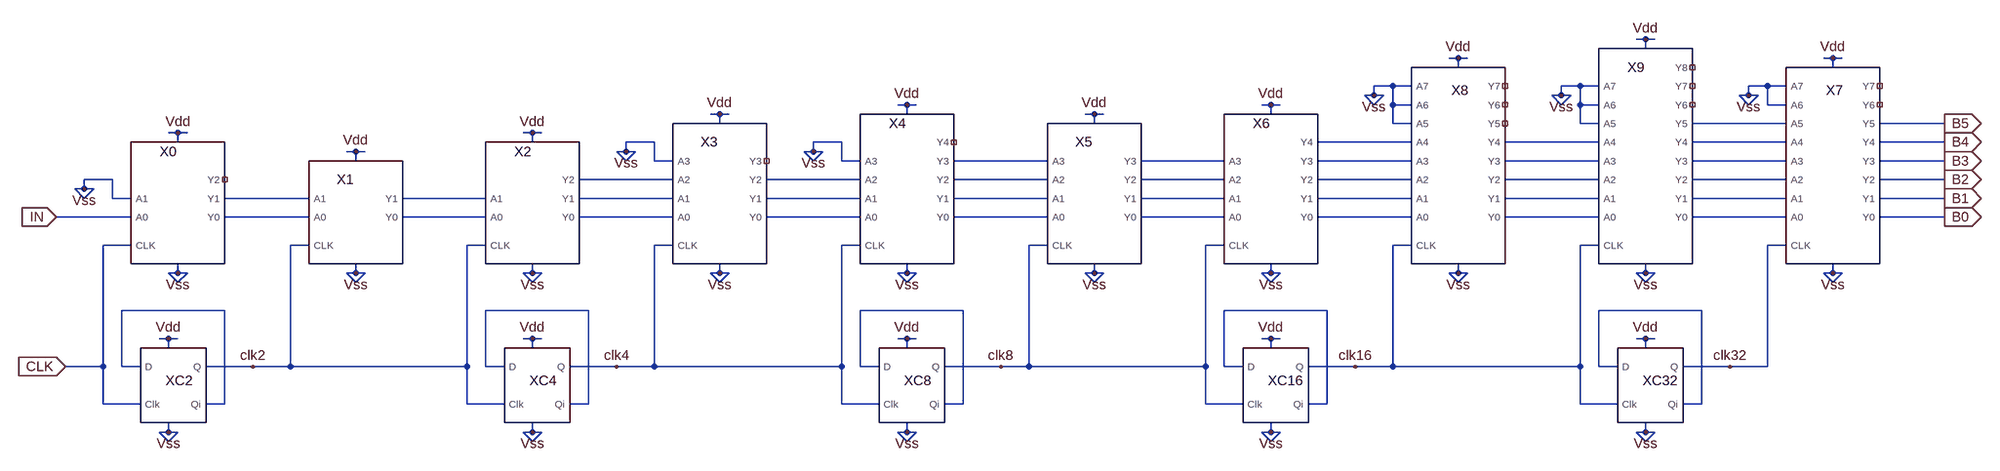
[diagram p0: schematic 5bit_sinc_filter_1st_order.asc]
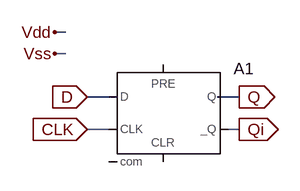
[diagram p1: sub-circuit dff.asc]
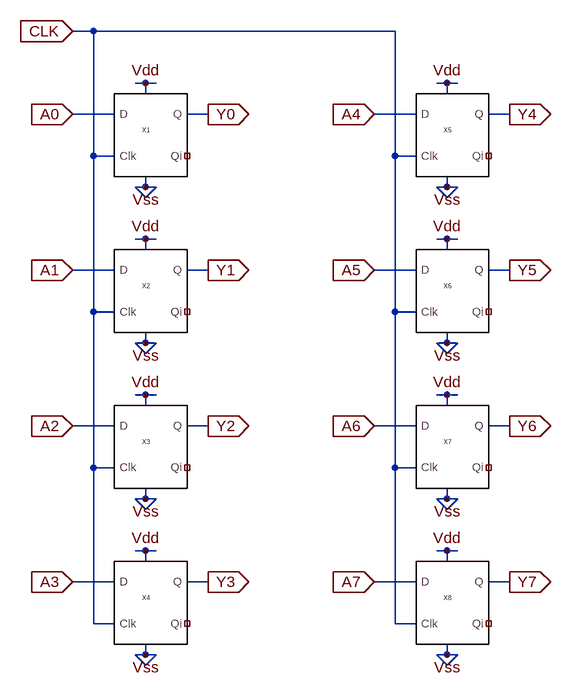
[diagram p2: sub-circuit 8bitreg.asc]
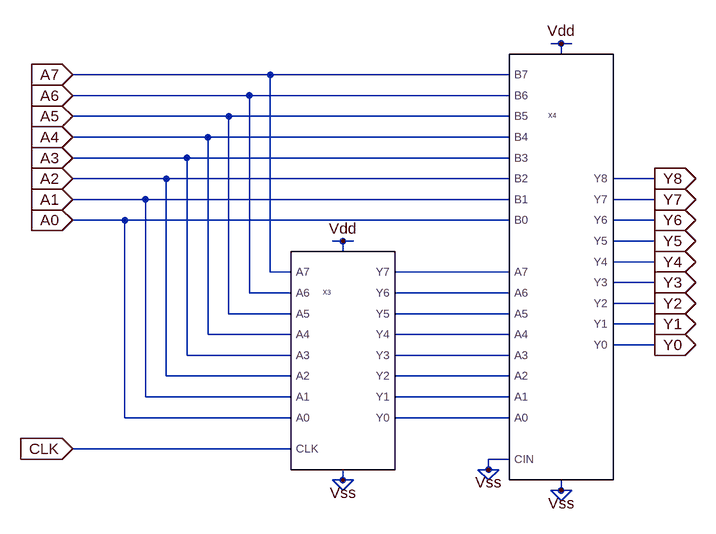
[diagram p3: sub-circuit 8bitavg.asc]
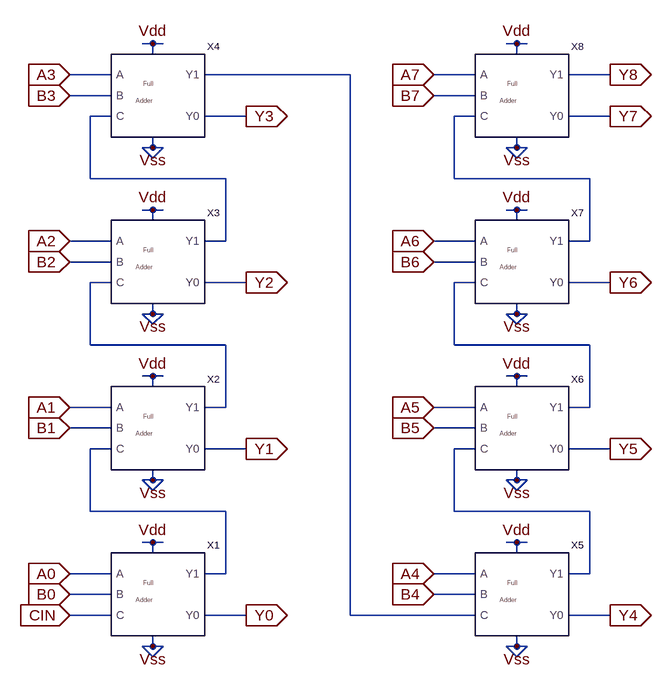
[diagram p4: sub-circuit 8bitadder.asc]
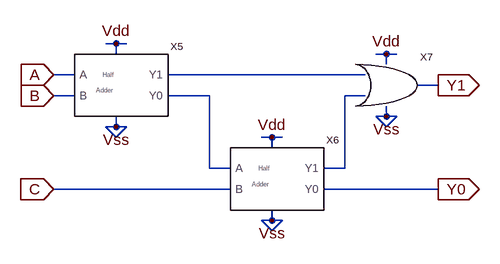
[diagram p5: sub-circuit fulladder.asc]
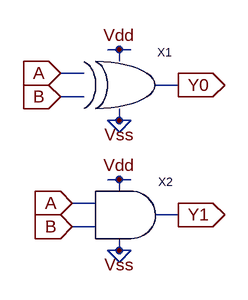
[diagram p6: sub-circuit halfadder.asc]
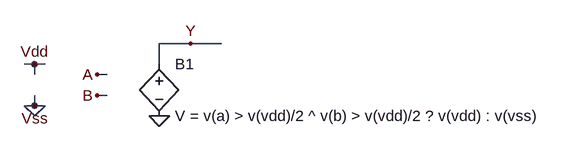
[diagram p7: sub-circuit xor.asc]
5bit_sinc_filter_1st_order.asc, the LTspice schematic file:
Version 4
SHEET 1 4532 1092
WIRE 2544 48 2528 48
WIRE 2560 48 2544 48
WIRE 2544 64 2544 48
WIRE 2224 80 2208 80
WIRE 2240 80 2224 80
WIRE 2864 80 2848 80
WIRE 2880 80 2864 80
WIRE 2224 96 2224 80
WIRE 2864 96 2864 80
WIRE 2112 128 2080 128
WIRE 2144 128 2112 128
WIRE 2432 128 2400 128
WIRE 2464 128 2432 128
WIRE 2752 128 2720 128
WIRE 2784 128 2752 128
WIRE 2080 144 2080 128
WIRE 2080 144 2064 144
WIRE 2096 144 2080 144
WIRE 2400 144 2400 128
WIRE 2400 144 2384 144
WIRE 2416 144 2400 144
WIRE 2720 144 2720 128
WIRE 2720 144 2704 144
WIRE 2736 144 2720 144
WIRE 1264 160 1248 160
WIRE 1280 160 1264 160
WIRE 1904 160 1888 160
WIRE 1920 160 1904 160
WIRE 2080 160 2064 144
WIRE 2080 160 2096 144
WIRE 2112 160 2112 128
WIRE 2144 160 2112 160
WIRE 2400 160 2384 144
WIRE 2400 160 2416 144
WIRE 2432 160 2432 128
WIRE 2464 160 2432 160
WIRE 2720 160 2704 144
WIRE 2720 160 2736 144
WIRE 2752 160 2752 128
WIRE 2784 160 2752 160
WIRE 944 176 928 176
WIRE 960 176 944 176
WIRE 1264 176 1264 160
WIRE 1584 176 1568 176
WIRE 1600 176 1584 176
WIRE 1904 176 1904 160
WIRE 944 192 944 176
WIRE 1584 192 1584 176
WIRE 2112 192 2112 160
WIRE 2144 192 2112 192
WIRE 2432 192 2432 160
WIRE 2464 192 2432 192
WIRE 2784 192 2624 192
WIRE 3136 192 2944 192
WIRE 0 208 -16 208
WIRE 16 208 0 208
WIRE 624 208 608 208
WIRE 640 208 624 208
WIRE 0 224 0 208
WIRE 624 224 624 208
WIRE 832 224 784 224
WIRE 1152 224 1104 224
WIRE 2144 224 1984 224
WIRE 2464 224 2304 224
WIRE 2784 224 2624 224
WIRE 3136 224 2944 224
WIRE 304 240 288 240
WIRE 320 240 304 240
WIRE 784 240 784 224
WIRE 784 240 768 240
WIRE 800 240 784 240
WIRE 1104 240 1104 224
WIRE 1104 240 1088 240
WIRE 1120 240 1104 240
WIRE 304 256 304 240
WIRE 784 256 768 240
WIRE 784 256 800 240
WIRE 832 256 832 224
WIRE 864 256 832 256
WIRE 1104 256 1088 240
WIRE 1104 256 1120 240
WIRE 1152 256 1152 224
WIRE 1184 256 1152 256
WIRE 1504 256 1344 256
WIRE 1824 256 1664 256
WIRE 2144 256 1984 256
WIRE 2464 256 2304 256
WIRE 2784 256 2624 256
WIRE 3136 256 2944 256
WIRE -112 288 -160 288
WIRE 864 288 704 288
WIRE 1184 288 1024 288
WIRE 1504 288 1344 288
WIRE 1824 288 1664 288
WIRE 2144 288 1984 288
WIRE 2464 288 2304 288
WIRE 2784 288 2624 288
WIRE 3136 288 2944 288
WIRE -160 304 -160 288
WIRE -160 304 -176 304
WIRE -144 304 -160 304
WIRE -160 320 -176 304
WIRE -160 320 -144 304
WIRE -112 320 -112 288
WIRE -80 320 -112 320
WIRE 224 320 80 320
WIRE 544 320 384 320
WIRE 864 320 704 320
WIRE 1184 320 1024 320
WIRE 1504 320 1344 320
WIRE 1824 320 1664 320
WIRE 2144 320 1984 320
WIRE 2464 320 2304 320
WIRE 2784 320 2624 320
WIRE 3136 320 2944 320
WIRE -80 352 -208 352
WIRE 224 352 80 352
WIRE 544 352 384 352
WIRE 864 352 704 352
WIRE 1184 352 1024 352
WIRE 1504 352 1344 352
WIRE 1824 352 1664 352
WIRE 2144 352 1984 352
WIRE 2464 352 2304 352
WIRE 2784 352 2624 352
WIRE 3136 352 2944 352
WIRE -80 400 -128 400
WIRE 224 400 192 400
WIRE 544 400 512 400
WIRE 864 400 832 400
WIRE 1184 400 1152 400
WIRE 1504 400 1472 400
WIRE 1824 400 1792 400
WIRE 2144 400 2112 400
WIRE 2464 400 2432 400
WIRE 2784 400 2752 400
WIRE 0 448 0 432
WIRE 0 448 -16 448
WIRE 16 448 0 448
WIRE 304 448 304 432
WIRE 304 448 288 448
WIRE 320 448 304 448
WIRE 624 448 624 432
WIRE 624 448 608 448
WIRE 640 448 624 448
WIRE 944 448 944 432
WIRE 944 448 928 448
WIRE 960 448 944 448
WIRE 1264 448 1264 432
WIRE 1264 448 1248 448
WIRE 1280 448 1264 448
WIRE 1584 448 1584 432
WIRE 1584 448 1568 448
WIRE 1600 448 1584 448
WIRE 1904 448 1904 432
WIRE 1904 448 1888 448
WIRE 1920 448 1904 448
WIRE 2224 448 2224 432
WIRE 2224 448 2208 448
WIRE 2240 448 2224 448
WIRE 2544 448 2544 432
WIRE 2544 448 2528 448
WIRE 2560 448 2544 448
WIRE 2864 448 2864 432
WIRE 2864 448 2848 448
WIRE 2880 448 2864 448
WIRE 0 464 -16 448
WIRE 0 464 16 448
WIRE 304 464 288 448
WIRE 304 464 320 448
WIRE 624 464 608 448
WIRE 624 464 640 448
WIRE 944 464 928 448
WIRE 944 464 960 448
WIRE 1264 464 1248 448
WIRE 1264 464 1280 448
WIRE 1584 464 1568 448
WIRE 1584 464 1600 448
WIRE 1904 464 1888 448
WIRE 1904 464 1920 448
WIRE 2224 464 2208 448
WIRE 2224 464 2240 448
WIRE 2544 464 2528 448
WIRE 2544 464 2560 448
WIRE 2864 464 2848 448
WIRE 2864 464 2880 448
WIRE 80 512 -96 512
WIRE 720 512 544 512
WIRE 1360 512 1184 512
WIRE 2000 512 1824 512
WIRE 2640 512 2464 512
WIRE -16 560 -32 560
WIRE 0 560 -16 560
WIRE 624 560 608 560
WIRE 640 560 624 560
WIRE 1264 560 1248 560
WIRE 1280 560 1264 560
WIRE 1904 560 1888 560
WIRE 1920 560 1904 560
WIRE 2544 560 2528 560
WIRE 2560 560 2544 560
WIRE -16 576 -16 560
WIRE 624 576 624 560
WIRE 1264 576 1264 560
WIRE 1904 576 1904 560
WIRE 2544 576 2544 560
WIRE -128 608 -128 400
WIRE -128 608 -192 608
WIRE -96 608 -96 512
WIRE -64 608 -96 608
WIRE 128 608 48 608
WIRE 192 608 192 400
WIRE 192 608 128 608
WIRE 512 608 512 400
WIRE 512 608 192 608
WIRE 544 608 544 512
WIRE 576 608 544 608
WIRE 768 608 688 608
WIRE 832 608 832 400
WIRE 832 608 768 608
WIRE 1152 608 1152 400
WIRE 1152 608 832 608
WIRE 1184 608 1184 512
WIRE 1216 608 1184 608
WIRE 1424 608 1328 608
WIRE 1472 608 1472 400
WIRE 1472 608 1424 608
WIRE 1792 608 1792 400
WIRE 1792 608 1472 608
WIRE 1824 608 1824 512
WIRE 1856 608 1824 608
WIRE 2048 608 1968 608
WIRE 2112 608 2112 400
WIRE 2112 608 2048 608
WIRE 2432 608 2432 400
WIRE 2432 608 2112 608
WIRE 2464 608 2464 512
WIRE 2496 608 2464 608
WIRE 2688 608 2608 608
WIRE 2752 608 2752 400
WIRE 2752 608 2688 608
WIRE -128 672 -128 608
WIRE -64 672 -128 672
WIRE 80 672 80 512
WIRE 80 672 48 672
WIRE 512 672 512 608
WIRE 576 672 512 672
WIRE 720 672 720 512
WIRE 720 672 688 672
WIRE 1152 672 1152 608
WIRE 1216 672 1152 672
WIRE 1360 672 1360 512
WIRE 1360 672 1328 672
WIRE 1792 672 1792 608
WIRE 1856 672 1792 672
WIRE 2000 672 2000 512
WIRE 2000 672 1968 672
WIRE 2432 672 2432 608
WIRE 2496 672 2432 672
WIRE 2640 672 2640 512
WIRE 2640 672 2608 672
WIRE -16 720 -16 704
WIRE -16 720 -32 720
WIRE 0 720 -16 720
WIRE 624 720 624 704
WIRE 624 720 608 720
WIRE 640 720 624 720
WIRE 1264 720 1264 704
WIRE 1264 720 1248 720
WIRE 1280 720 1264 720
WIRE 1904 720 1904 704
WIRE 1904 720 1888 720
WIRE 1920 720 1904 720
WIRE 2544 720 2544 704
WIRE 2544 720 2528 720
WIRE 2560 720 2544 720
WIRE -16 736 -32 720
WIRE -16 736 0 720
WIRE 624 736 608 720
WIRE 624 736 640 720
WIRE 1264 736 1248 720
WIRE 1264 736 1280 720
WIRE 1904 736 1888 720
WIRE 1904 736 1920 720
WIRE 2544 736 2528 720
WIRE 2544 736 2560 720
FLAG 304 448 Vss
FLAG 3136 352 B0
IOPIN 3136 352 Out
FLAG 3136 320 B1
IOPIN 3136 320 Out
FLAG 3136 288 B2
IOPIN 3136 288 Out
FLAG 3136 256 B3
IOPIN 3136 256 Out
FLAG 3136 224 B4
IOPIN 3136 224 Out
FLAG 3136 192 B5
IOPIN 3136 192 Out
FLAG -16 560 Vdd
FLAG -16 720 Vss
FLAG 0 448 Vss
FLAG 0 208 Vdd
FLAG -192 608 CLK
IOPIN -192 608 In
FLAG -208 352 IN
IOPIN -208 352 In
FLAG -160 304 Vss
FLAG 624 560 Vdd
FLAG 624 720 Vss
FLAG 944 448 Vss
FLAG 2224 80 Vdd
FLAG 2224 448 Vss
FLAG 1264 560 Vdd
FLAG 1264 720 Vss
FLAG 1264 448 Vss
FLAG 1264 160 Vdd
FLAG 1904 448 Vss
FLAG 1904 160 Vdd
FLAG 2080 144 Vss
FLAG 1904 560 Vdd
FLAG 1904 720 Vss
FLAG 2544 448 Vss
FLAG 2544 48 Vdd
FLAG 2864 448 Vss
FLAG 2400 144 Vss
FLAG 128 608 clk2
FLAG 768 608 clk4
FLAG 1424 608 clk8
FLAG 2048 608 clk16
FLAG 304 240 Vdd
FLAG 944 176 Vdd
FLAG 2720 144 Vss
FLAG 2544 560 Vdd
FLAG 2544 720 Vss
FLAG 2688 608 clk32
FLAG 624 448 Vss
FLAG 624 208 Vdd
FLAG 784 240 Vss
FLAG 1104 240 Vss
FLAG 1584 448 Vss
FLAG 1584 176 Vdd
FLAG 2864 80 Vdd
SYMBOL dff -64 704 R0
SYMATTR InstName XC2
SYMBOL dff 576 704 R0
SYMATTR InstName XC4
SYMBOL dff 1216 704 R0
SYMATTR InstName XC8
SYMBOL dff 1856 704 R0
SYMATTR InstName XC16
SYMBOL 8bitreg 2144 432 R0
WINDOW 1 88 -121 VLeft 0
WINDOW 0 68 -297 Left 0
SYMATTR InstName X8
SYMBOL 8bitavg 2464 432 R0
WINDOW 1 82 -126 VLeft 0
SYMATTR InstName X9
SYMBOL 2bitavg -80 432 R0
SYMATTR InstName X0
SYMBOL dff 2496 704 R0
SYMATTR InstName XC32
SYMBOL 2bitreg 224 432 R0
SYMATTR InstName X1
SYMBOL 2bitavg 544 432 R0
SYMATTR InstName X2
SYMBOL 4bitreg 864 432 R0
SYMATTR InstName X3
SYMBOL 4bitavg 1184 432 R0
SYMATTR InstName X4
SYMBOL 4bitreg 1504 432 R0
SYMATTR InstName X5
SYMBOL 4bitavg 1824 432 R0
SYMATTR InstName X6
SYMBOL 8bitreg 2784 432 R0
WINDOW 1 88 -121 VLeft 0
WINDOW 0 68 -297 Left 0
SYMATTR InstName X7

dff.asc, the sub-circuit schematic file:
Version 4
SHEET 1 880 680
WIRE 64 32 48 32
WIRE 64 64 48 64
WIRE 128 128 96 128
WIRE 320 128 288 128
WIRE 128 176 96 176
WIRE 320 176 304 176
FLAG 96 128 D
IOPIN 96 128 In
FLAG 96 176 CLK
IOPIN 96 176 In
FLAG 320 128 Q
IOPIN 320 128 Out
FLAG 320 176 Qi
IOPIN 320 176 Out
FLAG 48 32 Vdd
FLAG 48 64 Vss
SYMBOL Digital\\dflop 208 80 R0
SYMATTR InstName A1
SYMATTR SpiceLine vhigh=5 tau=1n

8bitreg.asc, the sub-circuit schematic file:
Version 4
SHEET 1 880 1012
WIRE -192 -224 -224 -224
WIRE 272 -224 -192 -224
WIRE -112 -144 -128 -144
WIRE -96 -144 -112 -144
WIRE 352 -144 336 -144
WIRE 368 -144 352 -144
WIRE -112 -128 -112 -144
WIRE 352 -128 352 -144
WIRE -160 -96 -224 -96
WIRE -16 -96 -48 -96
WIRE 304 -96 240 -96
WIRE 448 -96 416 -96
WIRE -192 -32 -192 -224
WIRE -160 -32 -192 -32
WIRE 272 -32 272 -224
WIRE 304 -32 272 -32
WIRE -112 16 -112 0
WIRE -112 16 -128 16
WIRE -96 16 -112 16
WIRE 352 16 352 0
WIRE 352 16 336 16
WIRE 368 16 352 16
WIRE -112 32 -128 16
WIRE -112 32 -96 16
WIRE 352 32 336 16
WIRE 352 32 368 16
WIRE -112 96 -128 96
WIRE -96 96 -112 96
WIRE 352 96 336 96
WIRE 368 96 352 96
WIRE -112 112 -112 96
WIRE 352 112 352 96
WIRE -160 144 -224 144
WIRE -16 144 -48 144
WIRE 304 144 240 144
WIRE 448 144 416 144
WIRE -192 208 -192 -32
WIRE -160 208 -192 208
WIRE 272 208 272 -32
WIRE 304 208 272 208
WIRE -112 256 -112 240
WIRE -112 256 -128 256
WIRE -96 256 -112 256
WIRE 352 256 352 240
WIRE 352 256 336 256
WIRE 368 256 352 256
WIRE -112 272 -128 256
WIRE -112 272 -96 256
WIRE 352 272 336 256
WIRE 352 272 368 256
WIRE -112 336 -128 336
WIRE -96 336 -112 336
WIRE 352 336 336 336
WIRE 368 336 352 336
WIRE -112 352 -112 336
WIRE 352 352 352 336
WIRE -160 384 -224 384
WIRE -16 384 -48 384
WIRE 304 384 240 384
WIRE 448 384 416 384
WIRE -192 448 -192 208
WIRE -160 448 -192 448
WIRE 272 448 272 208
WIRE 304 448 272 448
WIRE -112 496 -112 480
WIRE -112 496 -128 496
WIRE -96 496 -112 496
WIRE 352 496 352 480
WIRE 352 496 336 496
WIRE 368 496 352 496
WIRE -112 512 -128 496
WIRE -112 512 -96 496
WIRE 352 512 336 496
WIRE 352 512 368 496
WIRE -112 576 -128 576
WIRE -96 576 -112 576
WIRE 352 576 336 576
WIRE 368 576 352 576
WIRE -112 592 -112 576
WIRE 352 592 352 576
WIRE -160 624 -224 624
WIRE -16 624 -48 624
WIRE 304 624 240 624
WIRE 448 624 416 624
WIRE -192 688 -192 448
WIRE -160 688 -192 688
WIRE 272 688 272 448
WIRE 304 688 272 688
WIRE -112 736 -112 720
WIRE -112 736 -128 736
WIRE -96 736 -112 736
WIRE 352 736 352 720
WIRE 352 736 336 736
WIRE 368 736 352 736
WIRE -112 752 -128 736
WIRE -112 752 -96 736
WIRE 352 752 336 736
WIRE 352 752 368 736
FLAG -112 -144 Vdd
FLAG -112 16 Vss
FLAG -224 -96 A0
IOPIN -224 -96 In
FLAG -16 -96 Y0
IOPIN -16 -96 Out
FLAG -112 96 Vdd
FLAG -112 256 Vss
FLAG -224 144 A1
IOPIN -224 144 In
FLAG -16 144 Y1
IOPIN -16 144 Out
FLAG -112 336 Vdd
FLAG -112 496 Vss
FLAG -224 384 A2
IOPIN -224 384 In
FLAG -16 384 Y2
IOPIN -16 384 Out
FLAG -112 576 Vdd
FLAG -112 736 Vss
FLAG -224 624 A3
IOPIN -224 624 In
FLAG -16 624 Y3
IOPIN -16 624 Out
FLAG -224 -224 CLK
IOPIN -224 -224 In
FLAG 352 -144 Vdd
FLAG 352 16 Vss
FLAG 240 -96 A4
IOPIN 240 -96 In
FLAG 448 -96 Y4
IOPIN 448 -96 Out
FLAG 352 96 Vdd
FLAG 352 256 Vss
FLAG 240 144 A5
IOPIN 240 144 In
FLAG 448 144 Y5
IOPIN 448 144 Out
FLAG 352 336 Vdd
FLAG 352 496 Vss
FLAG 240 384 A6
IOPIN 240 384 In
FLAG 448 384 Y6
IOPIN 448 384 Out
FLAG 352 576 Vdd
FLAG 352 736 Vss
FLAG 240 624 A7
IOPIN 240 624 In
FLAG 448 624 Y7
IOPIN 448 624 Out
SYMBOL dff -160 0 R0
SYMATTR InstName X1
SYMBOL dff -160 240 R0
SYMATTR InstName X2
SYMBOL dff -160 480 R0
SYMATTR InstName X3
SYMBOL dff -160 720 R0
SYMATTR InstName X4
SYMBOL dff 304 0 R0
SYMATTR InstName X5
SYMBOL dff 304 240 R0
SYMATTR InstName X6
SYMBOL dff 304 480 R0
SYMATTR InstName X7
SYMBOL dff 304 720 R0
SYMATTR InstName X8

8bitavg.asc, the sub-circuit schematic file:
Version 4
SHEET 1 880 680
WIRE 96 -288 80 -288
WIRE 112 -288 96 -288
WIRE 96 -272 96 -288
WIRE -352 -240 -656 -240
WIRE 16 -240 -352 -240
WIRE -384 -208 -656 -208
WIRE 16 -208 -384 -208
WIRE -416 -176 -656 -176
WIRE 16 -176 -416 -176
WIRE -448 -144 -656 -144
WIRE 16 -144 -448 -144
WIRE -480 -112 -656 -112
WIRE 16 -112 -480 -112
WIRE -512 -80 -656 -80
WIRE 16 -80 -512 -80
WIRE 240 -80 176 -80
WIRE -544 -48 -656 -48
WIRE 16 -48 -544 -48
WIRE 240 -48 176 -48
WIRE -576 -16 -656 -16
WIRE 16 -16 -576 -16
WIRE 240 -16 176 -16
WIRE -240 16 -256 16
WIRE -224 16 -240 16
WIRE 240 16 176 16
WIRE -240 32 -240 16
WIRE 240 48 176 48
WIRE -352 64 -352 -240
WIRE -320 64 -352 64
WIRE 16 64 -160 64
WIRE 240 80 176 80
WIRE -384 96 -384 -208
WIRE -320 96 -384 96
WIRE 16 96 -160 96
WIRE 240 112 176 112
WIRE -416 128 -416 -176
WIRE -320 128 -416 128
WIRE 16 128 -160 128
WIRE 240 144 176 144
WIRE -448 160 -448 -144
WIRE -320 160 -448 160
WIRE 16 160 -160 160
WIRE 240 176 176 176
WIRE -480 192 -480 -112
WIRE -320 192 -480 192
WIRE 16 192 -160 192
WIRE -512 224 -512 -80
WIRE -320 224 -512 224
WIRE 16 224 -160 224
WIRE -544 256 -544 -48
WIRE -320 256 -544 256
WIRE 16 256 -160 256
WIRE -576 288 -576 -16
WIRE -320 288 -576 288
WIRE 16 288 -160 288
WIRE -320 336 -656 336
WIRE 16 352 -16 352
WIRE -16 368 -16 352
WIRE -16 368 -32 368
WIRE 0 368 -16 368
WIRE -240 384 -240 368
WIRE -240 384 -256 384
WIRE -224 384 -240 384
WIRE -16 384 -32 368
WIRE -16 384 0 368
WIRE -240 400 -256 384
WIRE -240 400 -224 384
WIRE 96 400 96 384
WIRE 96 400 80 400
WIRE 112 400 96 400
WIRE 96 416 80 400
WIRE 96 416 112 400
FLAG 96 -288 Vdd
FLAG 96 400 Vss
FLAG 240 176 Y0
IOPIN 240 176 Out
FLAG 240 144 Y1
IOPIN 240 144 Out
FLAG 240 112 Y2
IOPIN 240 112 Out
FLAG 240 80 Y3
IOPIN 240 80 Out
FLAG 240 48 Y4
IOPIN 240 48 Out
FLAG 240 16 Y5
IOPIN 240 16 Out
FLAG 240 -16 Y6
IOPIN 240 -16 Out
FLAG 240 -48 Y7
IOPIN 240 -48 Out
FLAG 240 -80 Y8
IOPIN 240 -80 Out
FLAG -16 368 Vss
FLAG -656 -16 A0
IOPIN -656 -16 In
FLAG -656 -48 A1
IOPIN -656 -48 In
FLAG -656 -80 A2
IOPIN -656 -80 In
FLAG -656 -112 A3
IOPIN -656 -112 In
FLAG -656 -144 A4
IOPIN -656 -144 In
FLAG -656 -176 A5
IOPIN -656 -176 In
FLAG -656 -208 A6
IOPIN -656 -208 In
FLAG -656 -240 A7
IOPIN -656 -240 In
FLAG -656 336 CLK
IOPIN -656 336 In
FLAG -240 384 Vss
FLAG -240 16 Vdd
SYMBOL 8bitreg -320 368 R0
SYMATTR InstName X3
SYMBOL 8bitadder 16 384 R0
SYMATTR InstName X4

8bitadder.asc, the sub-circuit schematic file:
Version 4
SHEET 1 1900 1012
WIRE 1104 32 1088 32
WIRE 1120 32 1104 32
WIRE 1664 32 1648 32
WIRE 1680 32 1664 32
WIRE 1104 48 1104 32
WIRE 1664 48 1664 32
WIRE 1040 80 976 80
WIRE 1408 80 1184 80
WIRE 1600 80 1536 80
WIRE 1808 80 1744 80
WIRE 1040 112 976 112
WIRE 1600 112 1536 112
WIRE 1040 144 1008 144
WIRE 1248 144 1184 144
WIRE 1600 144 1568 144
WIRE 1808 144 1744 144
WIRE 1104 192 1104 176
WIRE 1104 192 1088 192
WIRE 1120 192 1104 192
WIRE 1664 192 1664 176
WIRE 1664 192 1648 192
WIRE 1680 192 1664 192
WIRE 1104 208 1088 192
WIRE 1104 208 1120 192
WIRE 1664 208 1648 192
WIRE 1664 208 1680 192
WIRE 1008 240 1008 144
WIRE 1216 240 1008 240
WIRE 1568 240 1568 144
WIRE 1776 240 1568 240
WIRE 1104 288 1088 288
WIRE 1120 288 1104 288
WIRE 1664 288 1648 288
WIRE 1680 288 1664 288
WIRE 1104 304 1104 288
WIRE 1664 304 1664 288
WIRE 1040 336 976 336
WIRE 1216 336 1216 240
WIRE 1216 336 1184 336
WIRE 1600 336 1536 336
WIRE 1776 336 1776 240
WIRE 1776 336 1744 336
WIRE 1040 368 976 368
WIRE 1600 368 1536 368
WIRE 1040 400 1008 400
WIRE 1248 400 1184 400
WIRE 1600 400 1568 400
WIRE 1808 400 1744 400
WIRE 1104 448 1104 432
WIRE 1104 448 1088 448
WIRE 1120 448 1104 448
WIRE 1664 448 1664 432
WIRE 1664 448 1648 448
WIRE 1680 448 1664 448
WIRE 1104 464 1088 448
WIRE 1104 464 1120 448
WIRE 1664 464 1648 448
WIRE 1664 464 1680 448
WIRE 1008 496 1008 400
WIRE 1216 496 1008 496
WIRE 1568 496 1568 400
WIRE 1776 496 1568 496
WIRE 1104 544 1088 544
WIRE 1120 544 1104 544
WIRE 1664 544 1648 544
WIRE 1680 544 1664 544
WIRE 1104 560 1104 544
WIRE 1664 560 1664 544
WIRE 1040 592 976 592
WIRE 1216 592 1216 496
WIRE 1216 592 1184 592
WIRE 1600 592 1536 592
WIRE 1776 592 1776 496
WIRE 1776 592 1744 592
WIRE 1040 624 976 624
WIRE 1600 624 1536 624
WIRE 1040 656 1008 656
WIRE 1248 656 1184 656
WIRE 1600 656 1568 656
WIRE 1808 656 1744 656
WIRE 1104 704 1104 688
WIRE 1104 704 1088 704
WIRE 1120 704 1104 704
WIRE 1664 704 1664 688
WIRE 1664 704 1648 704
WIRE 1680 704 1664 704
WIRE 1104 720 1088 704
WIRE 1104 720 1120 704
WIRE 1664 720 1648 704
WIRE 1664 720 1680 704
WIRE 1008 752 1008 656
WIRE 1216 752 1008 752
WIRE 1568 752 1568 656
WIRE 1776 752 1568 752
WIRE 1104 800 1088 800
WIRE 1120 800 1104 800
WIRE 1664 800 1648 800
WIRE 1680 800 1664 800
WIRE 1104 816 1104 800
WIRE 1664 816 1664 800
WIRE 1040 848 976 848
WIRE 1216 848 1216 752
WIRE 1216 848 1184 848
WIRE 1600 848 1536 848
WIRE 1776 848 1776 752
WIRE 1776 848 1744 848
WIRE 1040 880 976 880
WIRE 1600 880 1536 880
WIRE 1040 912 976 912
WIRE 1248 912 1184 912
WIRE 1408 912 1408 80
WIRE 1600 912 1408 912
WIRE 1808 912 1744 912
WIRE 1104 960 1104 944
WIRE 1104 960 1088 960
WIRE 1120 960 1104 960
WIRE 1664 960 1664 944
WIRE 1664 960 1648 960
WIRE 1680 960 1664 960
WIRE 1104 976 1088 960
WIRE 1104 976 1120 960
WIRE 1664 976 1648 960
WIRE 1664 976 1680 960
FLAG 976 848 A0
IOPIN 976 848 In
FLAG 976 880 B0
IOPIN 976 880 In
FLAG 1104 800 Vdd
FLAG 1104 960 Vss
FLAG 976 592 A1
IOPIN 976 592 In
FLAG 976 624 B1
IOPIN 976 624 In
FLAG 1104 544 Vdd
FLAG 1104 704 Vss
FLAG 976 336 A2
IOPIN 976 336 In
FLAG 976 368 B2
IOPIN 976 368 In
FLAG 1104 288 Vdd
FLAG 1104 448 Vss
FLAG 976 80 A3
IOPIN 976 80 In
FLAG 976 112 B3
IOPIN 976 112 In
FLAG 1104 32 Vdd
FLAG 1104 192 Vss
FLAG 976 912 CIN
IOPIN 976 912 In
FLAG 1248 912 Y0
IOPIN 1248 912 Out
FLAG 1248 656 Y1
IOPIN 1248 656 Out
FLAG 1248 400 Y2
IOPIN 1248 400 Out
FLAG 1248 144 Y3
IOPIN 1248 144 Out
FLAG 1536 848 A4
IOPIN 1536 848 In
FLAG 1536 880 B4
IOPIN 1536 880 In
FLAG 1664 800 Vdd
FLAG 1664 960 Vss
FLAG 1536 592 A5
IOPIN 1536 592 In
FLAG 1536 624 B5
IOPIN 1536 624 In
FLAG 1664 544 Vdd
FLAG 1664 704 Vss
FLAG 1536 336 A6
IOPIN 1536 336 In
FLAG 1536 368 B6
IOPIN 1536 368 In
FLAG 1664 288 Vdd
FLAG 1664 448 Vss
FLAG 1536 80 A7
IOPIN 1536 80 In
FLAG 1536 112 B7
IOPIN 1536 112 In
FLAG 1664 32 Vdd
FLAG 1664 192 Vss
FLAG 1808 912 Y4
IOPIN 1808 912 Out
FLAG 1808 656 Y5
IOPIN 1808 656 Out
FLAG 1808 400 Y6
IOPIN 1808 400 Out
FLAG 1808 144 Y7
IOPIN 1808 144 Out
FLAG 1808 80 Y8
IOPIN 1808 80 Out
SYMBOL fulladder 1040 944 R0
SYMATTR InstName X1
SYMBOL fulladder 1040 688 R0
SYMATTR InstName X2
SYMBOL fulladder 1040 432 R0
SYMATTR InstName X3
SYMBOL fulladder 1040 176 R0
SYMATTR InstName X4
SYMBOL fulladder 1600 944 R0
SYMATTR InstName X5
SYMBOL fulladder 1600 688 R0
SYMATTR InstName X6
SYMBOL fulladder 1600 432 R0
SYMATTR InstName X7
SYMBOL fulladder 1600 176 R0
SYMATTR InstName X8

fulladder.asc, the sub-circuit schematic file:
Version 4
SHEET 1 1124 956
WIRE 112 64 96 64
WIRE 128 64 112 64
WIRE 112 80 112 64
WIRE 528 80 512 80
WIRE 544 80 528 80
WIRE 528 96 528 80
WIRE 48 112 16 112
WIRE 496 112 192 112
WIRE 608 128 576 128
WIRE 48 144 16 144
WIRE 256 144 192 144
WIRE 496 144 464 144
WIRE 528 176 528 160
WIRE 528 176 512 176
WIRE 544 176 528 176
WIRE 112 192 112 176
WIRE 112 192 96 192
WIRE 128 192 112 192
WIRE 528 192 512 176
WIRE 528 192 544 176
WIRE 112 208 96 192
WIRE 112 208 128 192
WIRE 352 208 336 208
WIRE 368 208 352 208
WIRE 352 224 352 208
WIRE 256 256 256 144
WIRE 288 256 256 256
WIRE 464 256 464 144
WIRE 464 256 432 256
WIRE 288 288 16 288
WIRE 608 288 432 288
WIRE 352 336 352 320
WIRE 352 336 336 336
WIRE 368 336 352 336
WIRE 352 352 336 336
WIRE 352 352 368 336
FLAG 112 64 Vdd
FLAG 112 192 Vss
FLAG 352 208 Vdd
FLAG 352 336 Vss
FLAG 608 288 Y0
IOPIN 608 288 Out
FLAG 16 112 A
IOPIN 16 112 In
FLAG 16 144 B
IOPIN 16 144 In
FLAG 16 288 C
IOPIN 16 288 In
FLAG 528 80 Vdd
FLAG 528 176 Vss
FLAG 608 128 Y1
IOPIN 608 128 Out
SYMBOL HalfAdder 48 176 R0
SYMATTR InstName X5
SYMBOL HalfAdder 288 320 R0
SYMATTR InstName X6
SYMBOL or 496 128 R0
SYMATTR InstName X7

halfadder.asc, the sub-circuit schematic file:
Version 4
SHEET 1 880 680
WIRE 96 240 80 240
WIRE 112 240 96 240
WIRE 96 256 96 240
WIRE 48 272 16 272
WIRE 176 288 144 288
WIRE 48 304 16 304
WIRE 96 336 96 320
WIRE 96 336 80 336
WIRE 112 336 96 336
WIRE 96 352 80 336
WIRE 96 352 112 336
WIRE 96 416 80 416
WIRE 112 416 96 416
WIRE 96 432 96 416
WIRE 64 448 32 448
WIRE 176 464 144 464
WIRE 64 480 32 480
WIRE 96 512 96 496
WIRE 96 512 80 512
WIRE 112 512 96 512
WIRE 96 528 80 512
WIRE 96 528 112 512
FLAG 16 272 A
IOPIN 16 272 In
FLAG 16 304 B
IOPIN 16 304 In
FLAG 176 288 Y0
IOPIN 176 288 Out
FLAG 96 240 Vdd
FLAG 96 336 Vss
FLAG 96 416 Vdd
FLAG 96 512 Vss
FLAG 32 448 A
IOPIN 32 448 In
FLAG 32 480 B
IOPIN 32 480 In
FLAG 176 464 Y1
IOPIN 176 464 Out
SYMBOL xor 48 288 R0
SYMATTR InstName X1
SYMBOL and 64 464 R0
SYMATTR InstName X2

xor.asc, the sub-circuit schematic file:
Version 4
SHEET 1 1264 952
WIRE 592 448 544 448
WIRE 640 448 592 448
WIRE 352 480 336 480
WIRE 368 480 352 480
WIRE 544 480 544 448
WIRE 352 496 352 480
WIRE 464 496 448 496
WIRE 464 528 448 528
WIRE 352 544 352 528
WIRE 352 544 336 544
WIRE 368 544 352 544
WIRE 352 560 336 544
WIRE 352 560 368 544
FLAG 448 496 A
FLAG 448 528 B
FLAG 352 480 Vdd
FLAG 352 544 Vss
FLAG 544 560 0
FLAG 592 448 Y
SYMBOL bv 544 464 R0
SYMATTR InstName B1
SYMATTR Value V = v(a) > v(vdd)/2 ^ v(b) > v(vdd)/2 ? v(vdd) : v(vss)

and.asc, the sub-circuit schematic file:
Version 4
SHEET 1 1192 680
WIRE 560 80 528 80
WIRE 336 112 320 112
WIRE 352 112 336 112
WIRE 528 112 528 80
WIRE 336 128 336 112
WIRE 464 128 448 128
WIRE 464 176 448 176
WIRE 336 192 336 176
WIRE 336 192 320 192
WIRE 352 192 336 192
WIRE 336 208 320 192
WIRE 336 208 352 192
FLAG 448 128 A
FLAG 448 176 B
FLAG 336 112 Vdd
FLAG 560 80 Y
IOPIN 560 80 Out
FLAG 336 192 Vss
FLAG 528 192 0
SYMBOL bv 528 96 R0
SYMATTR InstName B1
SYMATTR Value V=((v(a)>v(vdd)/2)&(v(b)>v(vdd)/2)) ? v(vdd) : v(vss)

or.asc, the sub-circuit schematic file:
Version 4
SHEET 1 1284 680
WIRE 656 0 640 0
WIRE 656 32 640 32
WIRE 656 112 624 112
WIRE 496 144 480 144
WIRE 512 144 496 144
WIRE 624 144 624 112
WIRE 496 160 496 144
WIRE 496 192 496 176
WIRE 496 192 480 192
WIRE 512 192 496 192
WIRE 496 208 480 192
WIRE 496 208 512 192
FLAG 656 112 Y
IOPIN 656 112 Out
FLAG 624 224 0
FLAG 640 0 A
IOPIN 640 0 In
FLAG 640 32 B
IOPIN 640 32 In
FLAG 496 144 Vdd
FLAG 496 192 Vss
SYMBOL bv 624 128 R0
SYMATTR InstName B1
SYMATTR Value V=v(a)>v(vdd)/2 | v(b)>v(vdd)/2 ? v(vdd) : v(vss)

2bitavg.asc, the sub-circuit schematic file:
Version 4
SHEET 1 880 680
WIRE 96 32 80 32
WIRE 112 32 96 32
WIRE 96 48 96 32
WIRE -288 112 -400 112
WIRE 16 112 -288 112
WIRE -320 144 -400 144
WIRE 16 144 -320 144
WIRE -176 176 -192 176
WIRE -160 176 -176 176
WIRE 240 176 176 176
WIRE -176 192 -176 176
WIRE 240 208 176 208
WIRE 240 240 176 240
WIRE -288 256 -288 112
WIRE -256 256 -288 256
WIRE 16 256 -96 256
WIRE -320 288 -320 144
WIRE -256 288 -320 288
WIRE 16 288 -96 288
WIRE -256 336 -400 336
WIRE 16 352 -16 352
WIRE -16 368 -16 352
WIRE -16 368 -32 368
WIRE 0 368 -16 368
WIRE -176 384 -176 368
WIRE -176 384 -192 384
WIRE -160 384 -176 384
WIRE -16 384 -32 368
WIRE -16 384 0 368
WIRE -176 400 -192 384
WIRE -176 400 -160 384
WIRE 96 400 96 384
WIRE 96 400 80 400
WIRE 112 400 96 400
WIRE 96 416 80 400
WIRE 96 416 112 400
FLAG 96 32 Vdd
FLAG 96 400 Vss
FLAG 240 240 Y0
IOPIN 240 240 Out
FLAG 240 208 Y1
IOPIN 240 208 Out
FLAG 240 176 Y2
IOPIN 240 176 Out
FLAG -16 368 Vss
FLAG -400 144 A0
IOPIN -400 144 In
FLAG -400 112 A1
IOPIN -400 112 In
FLAG -400 336 CLK
IOPIN -400 336 In
FLAG -176 384 Vss
FLAG -176 176 Vdd
SYMBOL 2bitreg -256 368 R0
SYMATTR InstName X1
SYMBOL 2bitadder 16 384 R0
SYMATTR InstName X2

2bitreg.asc, the sub-circuit schematic file:
Version 4
SHEET 1 880 1012
WIRE -192 -224 -224 -224
WIRE -112 -144 -128 -144
WIRE -96 -144 -112 -144
WIRE -112 -128 -112 -144
WIRE -160 -96 -224 -96
WIRE -16 -96 -48 -96
WIRE -192 -32 -192 -224
WIRE -160 -32 -192 -32
WIRE -112 16 -112 0
WIRE -112 16 -128 16
WIRE -96 16 -112 16
WIRE -112 32 -128 16
WIRE -112 32 -96 16
WIRE -112 96 -128 96
WIRE -96 96 -112 96
WIRE -112 112 -112 96
WIRE -160 144 -224 144
WIRE -16 144 -48 144
WIRE -192 208 -192 -32
WIRE -160 208 -192 208
WIRE -112 256 -112 240
WIRE -112 256 -128 256
WIRE -96 256 -112 256
WIRE -112 272 -128 256
WIRE -112 272 -96 256
FLAG -112 -144 Vdd
FLAG -112 16 Vss
FLAG -224 -96 A0
IOPIN -224 -96 In
FLAG -16 -96 Y0
IOPIN -16 -96 Out
FLAG -112 96 Vdd
FLAG -112 256 Vss
FLAG -224 144 A1
IOPIN -224 144 In
FLAG -16 144 Y1
IOPIN -16 144 Out
FLAG -224 -224 CLK
IOPIN -224 -224 In
SYMBOL dff -160 0 R0
SYMATTR InstName X1
SYMBOL dff -160 240 R0
SYMATTR InstName X2

2bitadder.asc, the sub-circuit schematic file:
Version 4
SHEET 1 1900 1012
WIRE 1104 544 1088 544
WIRE 1120 544 1104 544
WIRE 1104 560 1104 544
WIRE 1040 592 976 592
WIRE 1248 592 1184 592
WIRE 1040 624 976 624
WIRE 1040 656 1008 656
WIRE 1248 656 1184 656
WIRE 1104 704 1104 688
WIRE 1104 704 1088 704
WIRE 1120 704 1104 704
WIRE 1104 720 1088 704
WIRE 1104 720 1120 704
WIRE 1008 752 1008 656
WIRE 1216 752 1008 752
WIRE 1104 800 1088 800
WIRE 1120 800 1104 800
WIRE 1104 816 1104 800
WIRE 1040 848 976 848
WIRE 1216 848 1216 752
WIRE 1216 848 1184 848
WIRE 1040 880 976 880
WIRE 1040 912 976 912
WIRE 1248 912 1184 912
WIRE 1104 960 1104 944
WIRE 1104 960 1088 960
WIRE 1120 960 1104 960
WIRE 1104 976 1088 960
WIRE 1104 976 1120 960
FLAG 976 848 A0
IOPIN 976 848 In
FLAG 976 880 B0
IOPIN 976 880 In
FLAG 1104 800 Vdd
FLAG 1104 960 Vss
FLAG 976 592 A1
IOPIN 976 592 In
FLAG 976 624 B1
IOPIN 976 624 In
FLAG 1104 544 Vdd
FLAG 1104 704 Vss
FLAG 976 912 CIN
IOPIN 976 912 In
FLAG 1248 912 Y0
IOPIN 1248 912 Out
FLAG 1248 656 Y1
IOPIN 1248 656 Out
FLAG 1248 592 Y2
IOPIN 1248 592 Out
SYMBOL fulladder 1040 944 R0
SYMATTR InstName X1
SYMBOL fulladder 1040 688 R0
SYMATTR InstName X2

4bitreg.asc, the sub-circuit schematic file:
Version 4
SHEET 1 880 1012
WIRE -192 -224 -224 -224
WIRE -112 -144 -128 -144
WIRE -96 -144 -112 -144
WIRE -112 -128 -112 -144
WIRE -160 -96 -224 -96
WIRE -16 -96 -48 -96
WIRE -192 -32 -192 -224
WIRE -160 -32 -192 -32
WIRE -112 16 -112 0
WIRE -112 16 -128 16
WIRE -96 16 -112 16
WIRE -112 32 -128 16
WIRE -112 32 -96 16
WIRE -112 96 -128 96
WIRE -96 96 -112 96
WIRE -112 112 -112 96
WIRE -160 144 -224 144
WIRE -16 144 -48 144
WIRE -192 208 -192 -32
WIRE -160 208 -192 208
WIRE -112 256 -112 240
WIRE -112 256 -128 256
WIRE -96 256 -112 256
WIRE -112 272 -128 256
WIRE -112 272 -96 256
WIRE -112 336 -128 336
WIRE -96 336 -112 336
WIRE -112 352 -112 336
WIRE -160 384 -224 384
WIRE -16 384 -48 384
WIRE -192 448 -192 208
WIRE -160 448 -192 448
WIRE -112 496 -112 480
WIRE -112 496 -128 496
WIRE -96 496 -112 496
WIRE -112 512 -128 496
WIRE -112 512 -96 496
WIRE -112 576 -128 576
WIRE -96 576 -112 576
WIRE -112 592 -112 576
WIRE -160 624 -224 624
WIRE -16 624 -48 624
WIRE -192 688 -192 448
WIRE -160 688 -192 688
WIRE -112 736 -112 720
WIRE -112 736 -128 736
WIRE -96 736 -112 736
WIRE -112 752 -128 736
WIRE -112 752 -96 736
FLAG -112 -144 Vdd
FLAG -112 16 Vss
FLAG -224 -96 A0
IOPIN -224 -96 In
FLAG -16 -96 Y0
IOPIN -16 -96 Out
FLAG -112 96 Vdd
FLAG -112 256 Vss
FLAG -224 144 A1
IOPIN -224 144 In
FLAG -16 144 Y1
IOPIN -16 144 Out
FLAG -112 336 Vdd
FLAG -112 496 Vss
FLAG -224 384 A2
IOPIN -224 384 In
FLAG -16 384 Y2
IOPIN -16 384 Out
FLAG -112 576 Vdd
FLAG -112 736 Vss
FLAG -224 624 A3
IOPIN -224 624 In
FLAG -16 624 Y3
IOPIN -16 624 Out
FLAG -224 -224 CLK
IOPIN -224 -224 In
SYMBOL dff -160 0 R0
SYMATTR InstName X1
SYMBOL dff -160 240 R0
SYMATTR InstName X2
SYMBOL dff -160 480 R0
SYMATTR InstName X3
SYMBOL dff -160 720 R0
SYMATTR InstName X4

4bitavg.asc, the sub-circuit schematic file:
Version 4
SHEET 1 880 680
WIRE 96 -80 80 -80
WIRE 112 -80 96 -80
WIRE 96 -64 96 -80
WIRE -480 -16 -656 -16
WIRE 16 -16 -480 -16
WIRE -512 16 -656 16
WIRE 16 16 -512 16
WIRE -544 48 -656 48
WIRE 16 48 -544 48
WIRE 240 48 176 48
WIRE -576 80 -656 80
WIRE 16 80 -576 80
WIRE 240 80 176 80
WIRE -240 112 -256 112
WIRE -224 112 -240 112
WIRE 240 112 176 112
WIRE -240 128 -240 112
WIRE 240 144 176 144
WIRE 240 176 176 176
WIRE -480 192 -480 -16
WIRE -320 192 -480 192
WIRE 16 192 -160 192
WIRE -512 224 -512 16
WIRE -320 224 -512 224
WIRE 16 224 -160 224
WIRE -544 256 -544 48
WIRE -320 256 -544 256
WIRE 16 256 -160 256
WIRE -576 288 -576 80
WIRE -320 288 -576 288
WIRE 16 288 -160 288
WIRE -320 336 -656 336
WIRE 16 352 -16 352
WIRE -16 368 -16 352
WIRE -16 368 -32 368
WIRE 0 368 -16 368
WIRE -240 384 -240 368
WIRE -240 384 -256 384
WIRE -224 384 -240 384
WIRE -16 384 -32 368
WIRE -16 384 0 368
WIRE -240 400 -256 384
WIRE -240 400 -224 384
WIRE 96 400 96 384
WIRE 96 400 80 400
WIRE 112 400 96 400
WIRE 96 416 80 400
WIRE 96 416 112 400
FLAG 96 -80 Vdd
FLAG 96 400 Vss
FLAG 240 176 Y0
IOPIN 240 176 Out
FLAG 240 144 Y1
IOPIN 240 144 Out
FLAG 240 112 Y2
IOPIN 240 112 Out
FLAG 240 80 Y3
IOPIN 240 80 Out
FLAG 240 48 Y4
IOPIN 240 48 Out
FLAG -16 368 Vss
FLAG -656 80 A0
IOPIN -656 80 In
FLAG -656 48 A1
IOPIN -656 48 In
FLAG -656 16 A2
IOPIN -656 16 In
FLAG -656 -16 A3
IOPIN -656 -16 In
FLAG -656 336 CLK
IOPIN -656 336 In
FLAG -240 384 Vss
FLAG -240 112 Vdd
SYMBOL 4bitreg -320 368 R0
WINDOW 0 64 -210 Left 0
SYMATTR InstName X1
SYMBOL 4bitadder 16 384 R0
WINDOW 0 60 -385 Left 0
SYMATTR InstName X2

4bitadder.asc, the sub-circuit schematic file:
Version 4
SHEET 1 1900 1012
WIRE 1104 32 1088 32
WIRE 1120 32 1104 32
WIRE 1104 48 1104 32
WIRE 1040 80 976 80
WIRE 1248 80 1184 80
WIRE 1040 112 976 112
WIRE 1040 144 1008 144
WIRE 1248 144 1184 144
WIRE 1104 192 1104 176
WIRE 1104 192 1088 192
WIRE 1120 192 1104 192
WIRE 1104 208 1088 192
WIRE 1104 208 1120 192
WIRE 1008 240 1008 144
WIRE 1216 240 1008 240
WIRE 1104 288 1088 288
WIRE 1120 288 1104 288
WIRE 1104 304 1104 288
WIRE 1040 336 976 336
WIRE 1216 336 1216 240
WIRE 1216 336 1184 336
WIRE 1040 368 976 368
WIRE 1040 400 1008 400
WIRE 1248 400 1184 400
WIRE 1104 448 1104 432
WIRE 1104 448 1088 448
WIRE 1120 448 1104 448
WIRE 1104 464 1088 448
WIRE 1104 464 1120 448
WIRE 1008 496 1008 400
WIRE 1216 496 1008 496
WIRE 1104 544 1088 544
WIRE 1120 544 1104 544
WIRE 1104 560 1104 544
WIRE 1040 592 976 592
WIRE 1216 592 1216 496
WIRE 1216 592 1184 592
WIRE 1040 624 976 624
WIRE 1040 656 1008 656
WIRE 1248 656 1184 656
WIRE 1104 704 1104 688
WIRE 1104 704 1088 704
WIRE 1120 704 1104 704
WIRE 1104 720 1088 704
WIRE 1104 720 1120 704
WIRE 1008 752 1008 656
WIRE 1216 752 1008 752
WIRE 1104 800 1088 800
WIRE 1120 800 1104 800
WIRE 1104 816 1104 800
WIRE 1040 848 976 848
WIRE 1216 848 1216 752
WIRE 1216 848 1184 848
WIRE 1040 880 976 880
WIRE 1040 912 976 912
WIRE 1248 912 1184 912
WIRE 1104 960 1104 944
WIRE 1104 960 1088 960
WIRE 1120 960 1104 960
WIRE 1104 976 1088 960
WIRE 1104 976 1120 960
FLAG 976 848 A0
IOPIN 976 848 In
FLAG 976 880 B0
IOPIN 976 880 In
FLAG 1104 800 Vdd
FLAG 1104 960 Vss
FLAG 976 592 A1
IOPIN 976 592 In
FLAG 976 624 B1
IOPIN 976 624 In
FLAG 1104 544 Vdd
FLAG 1104 704 Vss
FLAG 976 336 A2
IOPIN 976 336 In
FLAG 976 368 B2
IOPIN 976 368 In
FLAG 1104 288 Vdd
FLAG 1104 448 Vss
FLAG 976 80 A3
IOPIN 976 80 In
FLAG 976 112 B3
IOPIN 976 112 In
FLAG 1104 32 Vdd
FLAG 1104 192 Vss
FLAG 976 912 CIN
IOPIN 976 912 In
FLAG 1248 912 Y0
IOPIN 1248 912 Out
FLAG 1248 656 Y1
IOPIN 1248 656 Out
FLAG 1248 400 Y2
IOPIN 1248 400 Out
FLAG 1248 144 Y3
IOPIN 1248 144 Out
FLAG 1248 80 Y4
IOPIN 1248 80 Out
SYMBOL fulladder 1040 944 R0
SYMATTR InstName X1
SYMBOL fulladder 1040 688 R0
SYMATTR InstName X2
SYMBOL fulladder 1040 432 R0
SYMATTR InstName X3
SYMBOL fulladder 1040 176 R0
SYMATTR InstName X4

The netlist it stands for:
* 5bit_sinc_filter_1st_order.asc
XXC2 N035 CLK clk2 N035 Vdd Vss dff
XXC4 N036 clk2 clk4 N036 Vdd Vss dff
XXC8 N037 clk4 clk8 N037 Vdd Vss dff
XXC16 N038 clk8 clk16 N038 Vdd Vss dff
XX8 Vdd Vss clk16 N032 N023 N014 N007 N002 Vss Vss Vss N033 N024 N015 N008 N003 NC_01 NC_02 NC_03 8bitreg
XX9 Vdd Vss clk16 N033 N024 N015 N008 N003 Vss Vss Vss N034 N025 N016 N009 N004 N001 NC_04 NC_05 NC_06 8bitavg
XX0 Vdd Vss CLK IN Vss N026 N017 NC_07 2bitavg
XXC32 N039 clk16 clk32 N039 Vdd Vss dff
XX1 Vdd Vss clk2 N026 N017 N027 N018 2bitreg
XX2 Vdd Vss clk2 N027 N018 N028 N019 N010 2bitavg
XX3 Vdd Vss clk4 N028 N019 N010 Vss N029 N020 N011 NC_08 4bitreg
XX4 Vdd Vss clk4 N029 N020 N011 Vss N030 N021 N012 N005 NC_09 4bitavg
XX5 Vdd Vss clk8 N030 N021 N012 N005 N031 N022 N013 N006 4bitreg
XX6 Vdd Vss clk8 N031 N022 N013 N006 N032 N023 N014 N007 N002 4bitavg
XX7 Vdd Vss clk32 N034 N025 N016 N009 N004 N001 Vss Vss B0 B1 B2 B3 B4 B5 NC_10 NC_11 8bitreg

* block symbol definitions
.subckt dff D Clk Q Qi VDD Vss
A1 D 0 CLK 0 0 Qi Q 0 DFLOP vhigh=5 tau=1n
.ends dff

.subckt 8bitreg Vdd Vss CLK A0 A1 A2 A3 A4 A5 A6 A7 Y0 Y1 Y2 Y3 Y4 Y5 Y6 Y7
XX1 A0 CLK Y0 NC_01 Vdd Vss dff
XX2 A1 CLK Y1 NC_02 Vdd Vss dff
XX3 A2 CLK Y2 NC_03 Vdd Vss dff
XX4 A3 CLK Y3 NC_04 Vdd Vss dff
XX5 A4 CLK Y4 NC_05 Vdd Vss dff
XX6 A5 CLK Y5 NC_06 Vdd Vss dff
XX7 A6 CLK Y6 NC_07 Vdd Vss dff
XX8 A7 CLK Y7 NC_08 Vdd Vss dff
.ends 8bitreg

.subckt 8bitavg Vdd Vss CLK A0 A1 A2 A3 A4 A5 A6 A7 Y0 Y1 Y2 Y3 Y4 Y5 Y6 Y7 Y8
XX3 Vdd Vss CLK A0 A1 A2 A3 A4 A5 A6 A7 N008 N007 N006 N005 N004 N003 N002 N001 8bitreg
XX4 Vdd Vss Vss N008 N007 N006 N005 N004 N003 N002 N001 A0 A1 A2 A3 A4 A5 A6 A7 Y0 Y1 Y2 Y3 Y4 Y5 Y6 Y7 Y8 8bitadder
.ends 8bitavg

.subckt 8bitadder Vdd Vss CIN A0 A1 A2 A3 A4 A5 A6 A7 B0 B1 B2 B3 B4 B5 B6 B7 Y0 Y1 Y2 Y3 Y4 Y5 Y6 Y7 Y8
XX1 A0 B0 Y0 N006 Vdd Vss CIN fulladder
XX2 A1 B1 Y1 N004 Vdd Vss N006 fulladder
XX3 A2 B2 Y2 N002 Vdd Vss N004 fulladder
XX4 A3 B3 Y3 N001 Vdd Vss N002 fulladder
XX5 A4 B4 Y4 N007 Vdd Vss N001 fulladder
XX6 A5 B5 Y5 N005 Vdd Vss N007 fulladder
XX7 A6 B6 Y6 N003 Vdd Vss N005 fulladder
XX8 A7 B7 Y7 Y8 Vdd Vss N003 fulladder
.ends 8bitadder

.subckt fulladder A B Y0 Y1 Vdd Vss C
XX5 A B N002 N001 Vdd Vss halfadder
XX6 N002 C Y0 N003 Vdd Vss halfadder
XX7 N001 N003 Y1 Vdd Vss or
.ends fulladder

.subckt halfadder A B Y0 Y1 Vdd Vss
XX1 A B Y0 Vdd Vss xor
XX2 A B Y1 Vdd Vss and
.ends halfadder

.subckt xor A B Y Vdd Vss
B1 Y 0 V = v(a) > v(vdd)/2 ^ v(b) > v(vdd)/2 ? v(vdd) : v(vss)
.ends xor

.subckt and A B Y Vdd Vss
B1 Y 0 V=((v(a)>v(vdd)/2)&(v(b)>v(vdd)/2)) ? v(vdd) : v(vss)
.ends and

.subckt or A B Y Vdd Vss
B1 Y 0 V=v(a)>v(vdd)/2 | v(b)>v(vdd)/2 ? v(vdd) : v(vss)
.ends or

.subckt 2bitavg Vdd Vss CLK A0 A1 Y0 Y1 Y2
XX1 Vdd Vss CLK A0 A1 N002 N001 2bitreg
XX2 Vdd Vss Vss N002 N001 A0 A1 Y0 Y1 Y2 2bitadder
.ends 2bitavg

.subckt 2bitreg Vdd Vss CLK A0 A1 Y0 Y1
XX1 A0 CLK Y0 NC_01 Vdd Vss dff
XX2 A1 CLK Y1 NC_02 Vdd Vss dff
.ends 2bitreg

.subckt 2bitadder Vdd Vss CIN A0 A1 B0 B1 Y0 Y1 Y2
XX1 A0 B0 Y0 N001 Vdd Vss CIN fulladder
XX2 A1 B1 Y1 Y2 Vdd Vss N001 fulladder
.ends 2bitadder

.subckt 4bitreg Vdd Vss CLK A0 A1 A2 A3 Y0 Y1 Y2 Y3
XX1 A0 CLK Y0 NC_01 Vdd Vss dff
XX2 A1 CLK Y1 NC_02 Vdd Vss dff
XX3 A2 CLK Y2 NC_03 Vdd Vss dff
XX4 A3 CLK Y3 NC_04 Vdd Vss dff
.ends 4bitreg

.subckt 4bitavg Vdd Vss CLK A0 A1 A2 A3 Y0 Y1 Y2 Y3 Y4
XX1 Vdd Vss CLK A0 A1 A2 A3 N004 N003 N002 N001 4bitreg
XX2 Vdd Vss Vss N004 N003 N002 N001 A0 A1 A2 A3 Y0 Y1 Y2 Y3 Y4 4bitadder
.ends 4bitavg

.subckt 4bitadder Vdd Vss CIN A0 A1 A2 A3 B0 B1 B2 B3 Y0 Y1 Y2 Y3 Y4
XX1 A0 B0 Y0 N003 Vdd Vss CIN fulladder
XX2 A1 B1 Y1 N002 Vdd Vss N003 fulladder
XX3 A2 B2 Y2 N001 Vdd Vss N002 fulladder
XX4 A3 B3 Y3 Y4 Vdd Vss N001 fulladder
.ends 4bitadder

.backanno
.end